# Altium project WPT Round 3 RX.PrjPcb
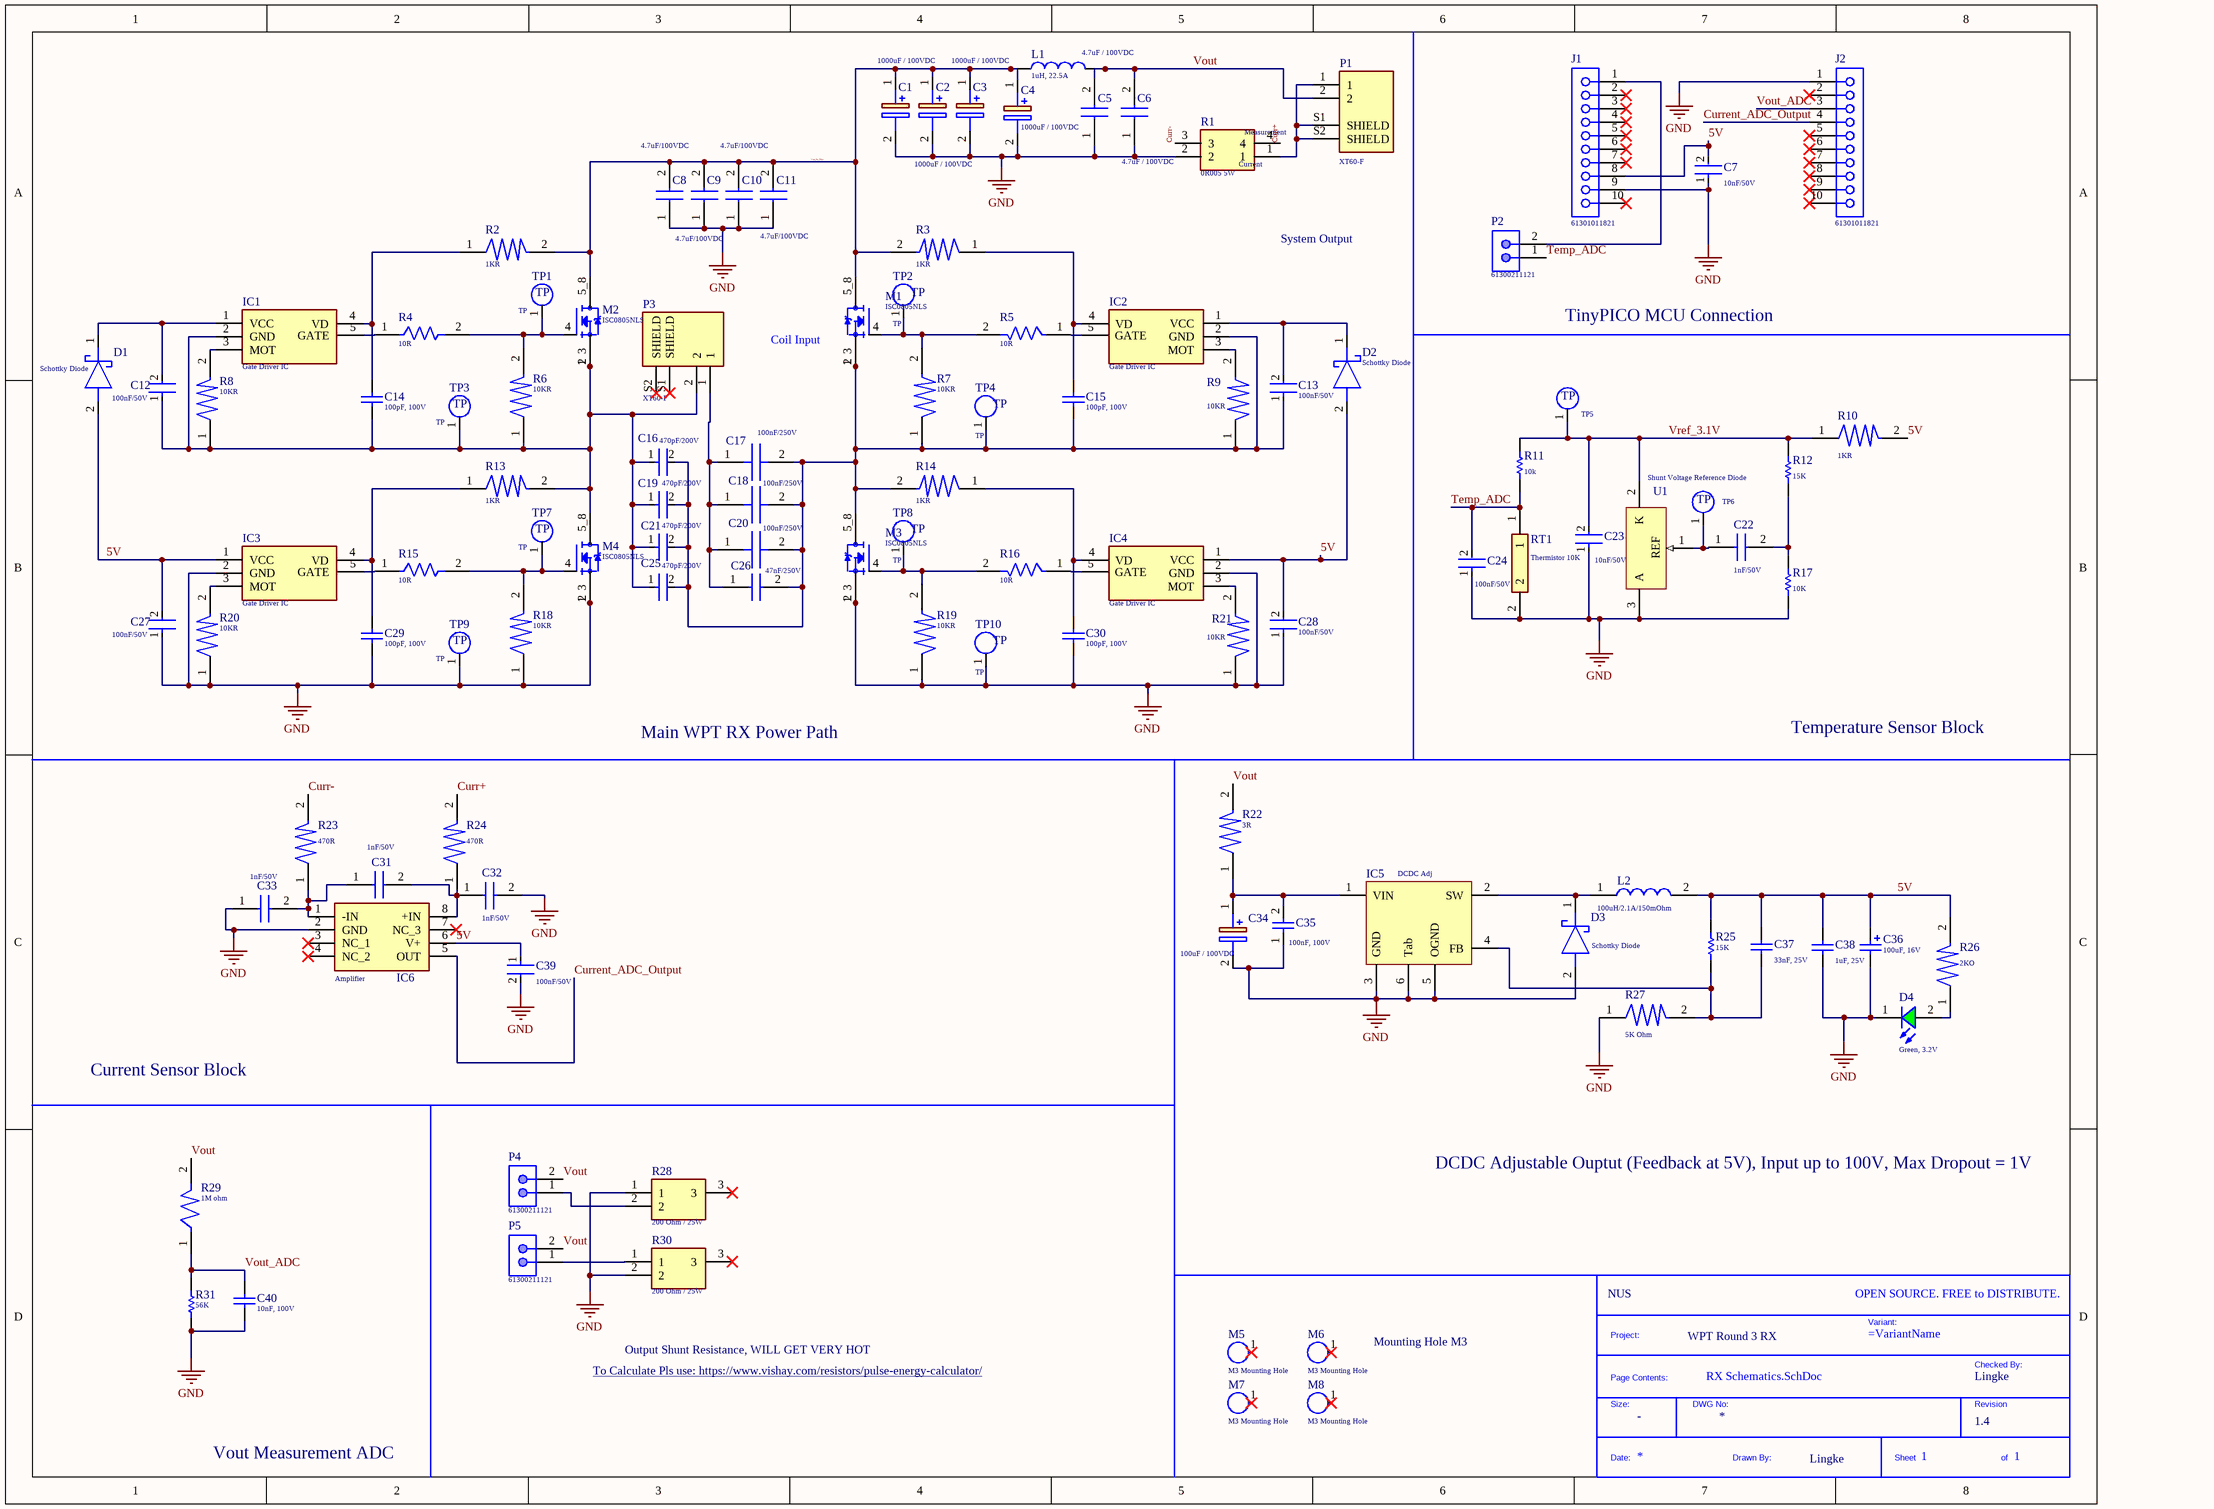
[diagram p0: RX Schematics.SchDoc]
1 sheet, 111 parts. Net scope: global (net labels, ports and power ports of the same name join across sheets).
Board file: RX Layout.PcbDoc

## Sheet RX Schematics.SchDoc
size A3; SheetNumber: 1; SheetTotal: 1

### Parts
*1  Project Name: WPT Round 3 RX  Company: NUS  Drawn By: Lingke  Revision: 1.4  (hidden comment: Title_Block)  (no BOM)
C1  1000uF / 100VDC  [CAPPRD750W80D1850H4200]
C2  1000uF / 100VDC  [CAPPRD750W80D1850H4200]
C3  1000uF / 100VDC  [CAPPRD750W80D1850H4200]
C4  1000uF / 100VDC  [CAPPRD750W80D1850H4200]
C5  4.7uF / 100VDC  [CAPC3225X280N]
C6  4.7uF / 100VDC  [CAPC3225X280N]
C7  10nF/50V  [0805 Capacitor]
C8  4.7uF/100VDC  [CAPC3225X280N]
C9  4.7uF/100VDC  [CAPC3225X280N]
C10  4.7uF/100VDC  [CAPC3225X280N]
C11  4.7uF/100VDC  [CAPC3225X280N]
C12  100nF/50V  [0805 Capacitor]
C13  100nF/50V  [0805 Capacitor]
C14  100pF, 100V  [WCAP-CSGP_0805_H=0.6mm_Reflow]
C15  100pF, 100V  [WCAP-CSGP_0805_H=0.6mm_Reflow]
C16  470pF/200V  [FP-C1206C-EB-MFG]
C17  100nF/250V  [CAPC4532X220N]
C18  100nF/250V  [CAPC4532X220N]
C19  470pF/200V  [FP-C1206C-EB-MFG]
C20  100nF/250V  [CAPC4532X220N]
C21  470pF/200V  [FP-C1206C-EB-MFG]
C22  1nF/50V  [CAPC2012X90N]
C23  10nF/50V  [0805 Capacitor]
C24  100nF/50V  [0805 Capacitor]
C25  470pF/200V  [FP-C1206C-EB-MFG]
C26  47nF/250V  [CAPC4532X350N]
C27  100nF/50V  [0805 Capacitor]
C28  100nF/50V  [0805 Capacitor]
C29  100pF, 100V  [WCAP-CSGP_0805_H=0.6mm_Reflow]
C30  100pF, 100V  [WCAP-CSGP_0805_H=0.6mm_Reflow]
C31  1nF/50V  [CAPC2012X90N]
C32  1nF/50V  [CAPC2012X90N]
C33  1nF/50V  [CAPC2012X90N]
C34  100uF / 100VDC  [CAPPRD500W60D1000H2200]
C35  100nF, 100V  [WCAP-CSGP_0805_H=1.25mm]
C36  100uF, 16V  [WCAP-ASLI_D6.3H5.5]
C37  33nF, 25V  [WCAP-CSGP_0805_H=0.8mm_Reflow]
C38  1uF, 25V  [WCAP-CSGP_0805_H=1.25mm]
C39  100nF/50V  [0805 Capacitor]
C40  10nF, 100V  [WCAP-CSGP_0805_H=0.8mm_Reflow]
D1  Schottky Diode  [RB400VAM50TR]
D2  Schottky Diode  [RB400VAM50TR]
D3  Schottky Diode  [DIONM8059X265N]
D4  Green, 3.2V  [WL-SMCW_0805]
IC1  Gate Driver IC  [SOT95P280X145-5N]
IC2  Gate Driver IC  [SOT95P280X145-5N]
IC3  Gate Driver IC  [SOT95P280X145-5N]
IC4  Gate Driver IC  [SOT95P280X145-5N]
IC5  DCDC Adj  [TO-263-5]
IC6  Amplifier  [SOIC127P600X175-8N]
J1  61301011821  [61301011821]
J2  61301011821  [61301011821]
L1  1uH, 22.5A  [7847227010]
L2  100uH/2.1A/150mOhm  [INDPM125125X800N]
M1  ISC0805NLS  [PG-TDSON-8]
M2  ISC0805NLS  [PG-TDSON-8]
M3  ISC0805NLS  [PG-TDSON-8]
M4  ISC0805NLS  [PG-TDSON-8]
M5  M3 Mounting Hole  [M3 Hole]
M6  M3 Mounting Hole  [M3 Hole]
M7  M3 Mounting Hole  [M3 Hole]
M8  M3 Mounting Hole  [M3 Hole]
P1  XT60-F  [AMASS_XT60PW-F]
P2  61300211121  [61300211121]
P3  XT60-F  [AMASS_XT60PW-F]
P4  61300211121  [61300211121]
P5  61300211121  [61300211121]
R1  0R005 5W  [FC4L110R005FER]
R2  1KR  [FP-CRCW0805-e3-MFG]
R3  1KR  [FP-CRCW0805-e3-MFG]
R4  10R  [FP-CRCW1206-e3-IPC_A]
R5  10R  [FP-CRCW1206-e3-IPC_A]
R6  10KR  [FP-CRCW0805-e3-MFG]
R7  10KR  [FP-CRCW0805-e3-MFG]
R8  10KR  [FP-CRCW0805-e3-MFG]
R9  10KR  [FP-CRCW0805-e3-MFG]
R10  1KR  [FP-CRCW0805-e3-MFG]
R11  10k  [0805 Resistor]
R12  15K  [0805 Resistor]
R13  1KR  [FP-CRCW0805-e3-MFG]
R14  1KR  [FP-CRCW0805-e3-MFG]
R15  10R  [FP-CRCW1206-e3-IPC_A]
R16  10R  [FP-CRCW1206-e3-IPC_A]
R17  10K  [0805 Resistor]
R18  10KR  [FP-CRCW0805-e3-MFG]
R19  10KR  [FP-CRCW0805-e3-MFG]
R20  10KR  [FP-CRCW0805-e3-MFG]
R21  10KR  [FP-CRCW0805-e3-MFG]
R22  3R  [1206_Resistor]
R23  470R  [FP-CRCW0805-e3-MFG]
R24  470R  [FP-CRCW0805-e3-MFG]
R25  15K  [0805 Resistor]
R26  2KO  [FP-CRCW0805-e3-MFG]
R27  5K Ohm  [FP-CRCW0805-e3-MFG]
R28  200 Ohm / 25W  [PWR163S253000FE]
R29  1M ohm  [FP-CRCW0805-e3-MFG]
R30  200 Ohm / 25W  [PWR163S253000FE]
R31  56K  [0805 Resistor]
RT1  Thermistor 10K  [THRMC2012X95N]
TP1  TP  [Test Point]  (no BOM)
TP2  TP  [Test Point]  (no BOM)
TP3  TP  [Test Point]  (no BOM)
TP4  TP  [Test Point]  (no BOM)
TP5  TP  [Test Point]  (value not drawn)  (no BOM)
TP6  TP  [Test Point]  (value not drawn)  (no BOM)
TP7  TP  [Test Point]  (no BOM)
TP8  TP  [Test Point]  (no BOM)
TP9  TP  [Test Point]  (no BOM)
TP10  TP  [Test Point]  (no BOM)
U1  Shunt Voltage Reference Diode  [SOT23-3_N]

### Nets
GND: C1.2(-) C2.2(-) C3.2(-) C4.2(-) C5.1 C6.1 C7.1 C8.1 C9.1 C10.1 C11.1 C23.1 C24.1 C27.1 C28.1 C29.1 C30.1 C32.2 C33.1 C34.2(-) C35.1 C36.2(N) C38.1 C39.2 C40.1 D3.2(A) D4.1(K) IC3.2(GND) IC4.2(GND) IC5.3(GND) IC5.5(OGND) IC5.6(Tab) IC6.2(GND) J1.9 J2.1 M3.1(S) M3.2(S) M3.3(S) M4.1(S) M4.2(S) M4.3(S) R1.2 R17.1 R18.1 R19.1 R20.1 R21.1 R27.1 R28.1 R30.2 R31.1 RT1.2 TP9.1(TP) TP10.1(TP) U1.3(A)
5V: C7.2 C27.2 C28.2 C36.1(P) C37.2 C38.2 C39.1 D1.2(A) D2.2(A) IC3.1(VCC) IC4.1(VCC) IC6.6(V+) J1.8 L2.2 R10.2 R25.2 R26.2
Curr+: R1.4 R24.2
Curr-: R1.3 R23.2
Current_ADC_Output: IC6.5(OUT) J2.4
Temp_ADC: C24.2 P2.1 R11.1 RT1.1
Vout: C5.2 C6.2 L1.2 P1.2 P4.2 P5.2 R22.2 R29.2
Vout_ADC: C40.2 J2.3 R29.1 R31.2
Vout_Pre_Filter: C1.1(+) C2.1(+) C3.1(+) C4.1(+) C8.2 C9.2 C10.2 C11.2 L1.1 M1.5_8(D) M2.5_8(D) R2.2 R3.2
Vref_3.1V: C23.2 R10.1 R11.2 R12.2 TP5.1(TP) U1.2(K)
NetC12_1: C12.1 C14.1 C16.1 C19.1 C21.1 C25.1 IC1.2(GND) M2.1(S) M2.2(S) M2.3(S) M4.5_8(D) P3.2 R6.1 R8.1 R13.2 TP3.1(TP)
NetC12_2: C12.2 D1.1(K) IC1.1(VCC)
NetC13_1: C13.1 C15.1 C16.2 C17.2 C18.2 C19.2 C20.2 C21.2 C25.2 C26.2 IC2.2(GND) M1.1(S) M1.2(S) M1.3(S) M3.5_8(D) R7.1 R9.1 R14.2 TP4.1(TP)
NetC13_2: C13.2 D2.1(K) IC2.1(VCC)
NetC14_2: C14.2 IC1.4(VD) R2.1
NetC15_2: C15.2 IC2.4(VD) R3.1
NetC17_1: C17.1 C18.1 C20.1 C26.1 P3.1
NetC22_1: C22.1 TP6.1(TP) U1.1(REF)
NetC22_2: C22.2 R12.1 R17.2
NetC29_2: C29.2 IC3.4(VD) R13.1
NetC30_2: C30.2 IC4.4(VD) R14.1
NetC31_1: C31.1 C33.2 IC6.1(-IN) R23.1
NetC31_2: C31.2 C32.1 IC6.8(+IN) R24.1
NetC34_1: C34.1(+) C35.2 IC5.1(VIN) R22.1
NetC37_1: C37.1 IC5.4(FB) R25.1 R27.2
NetD3_1: D3.1(K) IC5.2(SW) L2.1
NetD4_2: D4.2(A) R26.1
NetIC1_3: IC1.3(MOT) R8.2
NetIC1_5: IC1.5(GATE) R4.1
NetIC2_3: IC2.3(MOT) R9.2
NetIC2_5: IC2.5(GATE) R5.1
NetIC3_3: IC3.3(MOT) R20.2
NetIC3_5: IC3.5(GATE) R15.1
NetIC4_3: IC4.3(MOT) R21.2
NetIC4_5: IC4.5(GATE) R16.1
NetJ1_1: J1.1 P2.2
NetM1_4: M1.4(G) R5.2 R7.2 TP2.1(TP)
NetM2_4: M2.4(G) R4.2 R6.2 TP1.1(TP)
NetM3_4: M3.4(G) R16.2 R19.2 TP8.1(TP)
NetM4_4: M4.4(G) R15.2 R18.2 TP7.1(TP)
NetP1_1: P1.1 P1.S1(SHIELD) P1.S2(SHIELD) R1.1
NetP4_1: P4.1 R28.2
NetP5_1: P5.1 R30.1

Not connected (* = marked no-connect by the designer): IC6 3(NC_1)* 4(NC_2)* 7(NC_3)*; J1 2* 3* 4* 5* 6* 7* 10*; J2 2* 5* 6* 7* 8* 9* 10*; M5 1*; M6 1*; M7 1*; M8 1*; P3 S1(SHIELD)* S2(SHIELD)*; R28 3*; R30 3*

### Notes on the sheet
- System Output
- (near M1) Coil Input
- TinyPICO MCU Connection
- Main WPT RX Power Path
- Temperature Sensor Block
- Current Sensor Block
- DCDC Adjustable Ouptut (Feedback at 5V), Input up to 100V, Max Dropout = 1V
- To Calculate Pls use: https://www.vishay.com/resistors/pulse-energy-calculator/ <https://www.vishay.com/resistors/pulse-energy-calculator/>
- Output Shunt Resistance, WILL GET VERY HOT
- Mounting Hole M3
- Vout Measurement ADC
- (in symbol FC4L110R005FER) Measurement; Current
- (in symbol Title_Block) OPEN SOURCE. FREE to DISTRIBUTE.; Variant:; Project:; Checked By:; Page Contents:; Size:; DWG No:; Revision; Date:; Drawn By:; Sheet; of

### Library data of the parts
*1 = Title_Block: Standard Title Block.; DWG No: *; Size: -; Checked By: Lingke
C1-C4 = UPW2A102MHD: Capacitor Polarised; Manufacturer_Name: Nichicon; Datasheet Link: http://www.nichicon.co.jp/english/products/pdfs/e-pw.pdf; Height: 42mm; Manufacturer_Part_Number: UPW2A102MHD; Mouser Part Number: 647-UPW2A102MHD; Mouser Price/Stock: https://www.mouser.co.uk/ProductDetail/Nichicon/UPW2A102MHD/?qs=vtm6YctIBsEhKvWuRIWL3Q%3D%3D; Arrow Part Number: UPW2A102MHD; Arrow Price/Stock: https://www.arrow.com/en/products/upw2a102mhd/nichicon
C5 C6 = CL32B475KCVZNWE: Capacitor; Manufacturer_Name: Samsung Electro-Mechanics; Height: 2.8mm; Manufacturer_Part_Number: CL32B475KCVZNWE
C7 C23 = 885012207092: Supplier 1: Mouser; Supplier Part Number 1: 710-885012207092
C8-C11 = CNC6P1X7R2A475K250AE: Manufacturer_Name: TDK; Datasheet Link: https://componentsearchengine.com//CNC6P1X7R2A475K250AE.pdf; Height: 2.8mm; Mouser2 Part Number: 810-CNC6P1X7R2A475K2; Mouser2 Price/Stock: https://www.mouser.com/Search/Refine.aspx?Keyword=810-CNC6P1X7R2A475K2; Manufacturer_Part_Number: CNC6P1X7R2A475K250AE; Supplier 1: Mouser; Supplier Part Number 1: 810-CNC6P1X7R2A475K2
C12 C13 C24 C27 C28 C39 = 885012207098: Supplier 1: Mouser; Supplier Part Number 1: 710-885012207098
C14 C15 C29 C30 = 885012007082: WCAP-CSGP Multilayer Ceramic Chip Capacitor, General Purpose, size 0805, NP0, 100pF, 100V; Manufacturer: Wurth Elektronik; Rated Voltage: 100VDC; Isolation Resistance  min.: 10GOhm; Capacitance Tolerance: +/-5%; Technical Reference: NP00805101J100DFCT10000; Q-Factor min.: 1000; ComponentLink1Description: Manufacturer; ComponentLink1URL: http://www.we-online.de; ComponentLink2Description: Datasheet; ComponentLink2URL: https://www.we-online.com/catalog/datasheet/885012007082.pdf; Operating Temperature: -55 to +125degC; Packaging: Tape and Reel; Manufacturer Part Number: 885012007082; Published Date: April 2021; Ceramic Type: NP0; Dissipation Factor max.: -; Height: 0.6mm; Mounting Technology: SMT; Size: 0805; Capacitance: 100pF
C16 C19 C21 C25 = C1206C471K2GACTU: CAP CER 470PF 200V 10% NP0 1206; Manufacturer: KEMET; Temperature Coefficient: 15%; Material: Ceramic; Tolerance: 0.1; Automotive Grade: Grade 0; Temperature Characteristic: C0G; Temperature Range High: +150°C; Octopart: https://octopart.com/c1206c471k2gactu-kemet-3658280; Value: 470 pF; ComponentLink2URL: https://content.kemet.com/datasheets/KEM_C1007_X8R_ULTRA_150C_SMD.pdf; Package: C1206C-EB; Ipc Land Pattern Name: CAPC320160X78; Digikey Description: CAP CER 470PF 200V 10% NP0 1206; Device Class L2: Capacitors; Lead Free: Yes; Voltage Rating: 200 V; ComponentLink2Description: Datasheet; Height: 0.88mm; RoHS: TRUE; Temperature Range Low: -55°C; Device Class L1: Passive Components; Device Class L3: Ceramic Capacitors; Category: Cap; Mouser Description: Multilayer Ceramic Capacitors MLCC - SMD/SMT 200volts 470pF C0G 10%; Temperature: -55°C to +150°C; Capacitance: 470 pF; Manufacturer Part Number: C1206C471K2GACTU; Automotive: Yes
C17 C18 C20 = C1812C104JAGACAUTO: Manufacturer_Name: Kemet; Datasheet Link: https://api.kemet.com/component-edge/download/datasheet/C1812C104JAGACAUTO.pdf; Height: 2.2mm; Manufacturer_Part_Number: C1812C104JAGACAUTO; Supplier Part Number 1: 80-C1812C104JAGAUTO; Supplier 1: Mouser
C22 C31-C33 = 885012207086: Manufacturer_Name: Wurth Elektronik; Datasheet Link: https://katalog.we-online.com/pbs/datasheet/885012207086.pdf; Height: 0.9mm; Manufacturer_Part_Number: 885012207086; Supplier 1: Mouser; Supplier Part Number 1: 710-885012207086
C26 = C4532C0G2E473J320KA: Capacitor / 47nF/250V / C0G; Manufacturer_Name: TDK; Datasheet Link: https://product.tdk.com/info/en/catalog/datasheets/mlcc_commercial_midvoltage_en.pdf; Height: 3.5mm; Manufacturer_Part_Number: C4532C0G2E473J320KA; Supplier 1: Mouser; Supplier Part Number 1: 810-C4532C0G2E473J
C34 = ESH107M100AH4AA: Capacitor Polarised; Manufacturer_Name: Kemet; Datasheet Link: https://componentsearchengine.com/Datasheets/1/ESH107M100AH4AA.pdf; Height: 22mm; Manufacturer_Part_Number: ESH107M100AH4AA; Mouser Part Number: 80-ESH107M100AH4AA; Mouser Price/Stock: https://www.mouser.co.uk/ProductDetail/KEMET/ESH107M100AH4AA?qs=gt1LBUVyoHkVRbiIYuZpEw%3D%3D
C35 = 885012207128: WCAP-CSGP Multilayer Ceramic Chip Capacitor, General Purpose, size 0805, X7R, 100nF, 100V; Manufacturer: Wurth Elektronik; Rated Voltage: 100VDC; Isolation Resistance: >=1GOhm; Capacitance Tolerance: +/-10%; Technical Reference: X7R0805104K100DFCT10000; ComponentLink1Description: Manufacturer; ComponentLink1URL: http://www.we-online.de; ComponentLink2Description: Datasheet; ComponentLink2URL: https://www.we-online.com/catalog/datasheet/885012207128.pdf; Operating Temperature: -55 to +125degC; Packaging: Tape and Reel; Manufacturer Part Number: 885012207128; Published Date: May 2020; Ceramic Type: X7R; Dissipation Factor: =<2.5%; Height: 1.25mm; Mounting Technology: SMT; Size: 0805; Capacitance: 100nF
C36 = 865080343009: WCAP-ASLI Aluminum Electrolytic Capacitor, V-Chip, SMT, D6.3xH5.5mm, 100uF, 16V; Manufacturer: Wurth Elektronik; Technical Reference: ASED055101M016DVCTBB000; Ripple Current: 255mA; Capacitance Tolerance: +/-20%; Leakage Current: 16uA; Endurance: 2000h; Dissipation Factor: 16%; Rated Voltage: 16VDC; Packaging: Tape and Reel; Published Date: October 2020; Operating Temperature: -55 to +105degC; Mounting Technology: SMT; Manufacturer Part Number: 865080343009; Height: 5.5mm; Capacitance: 100uF; ComponentLink1Description: Manufacturer; ComponentLink1URL: http://www.we-online.de; ComponentLink2Description: Datasheet; ComponentLink2URL: https://www.we-online.com/catalog/datasheet/865080343009.pdf; Diameter: 6.3mm
C37 = 885012207069: WCAP-CSGP Multilayer Ceramic Chip Capacitor, General Purpose, size 0805, X7R, 33nF, 25V; Manufacturer: Wurth Elektronik; Rated Voltage: 25VDC; Isolation Resistance  min.: 10GOhm; Capacitance Tolerance: +/-10%; Dissipation Factor max.: 3.5%; Technical Reference: X7R0805333K025DFCT10000; ComponentLink1Description: Manufacturer; ComponentLink1URL: http://www.we-online.de; ComponentLink2Description: Datasheet; ComponentLink2URL: https://www.we-online.com/catalog/datasheet/885012207069.pdf; Operating Temperature: -55 to +125degC; Packaging: Tape and Reel; Manufacturer Part Number: 885012207069; Published Date: April 2021; Ceramic Type: X7R; Height: 0.8mm; Mounting Technology: SMT; Size: 0805; Capacitance: 33nF; Q-Factor min.: -
C38 = 885012207078: WCAP-CSGP Multilayer Ceramic Chip Capacitor, General Purpose, size 0805, X7R, 1uF, 25V; Manufacturer: Wurth Elektronik; Rated Voltage: 25VDC; Isolation Resistance  min.: 0.5GOhm; Capacitance Tolerance: +/-10%; Dissipation Factor max.: 5%; Technical Reference: X7R0805105K025DFCT10000; ComponentLink1Description: Manufacturer; ComponentLink1URL: http://www.we-online.de; ComponentLink2Description: Datasheet; ComponentLink2URL: https://www.we-online.com/catalog/datasheet/885012207078.pdf; Operating Temperature: -55 to +125degC; Packaging: Tape and Reel; Manufacturer Part Number: 885012207078; Published Date: April 2021; Ceramic Type: X7R; Height: 1.25mm; Mounting Technology: SMT; Size: 0805; Capacitance: 1uF; Q-Factor min.: -
C40 = 885012207122: WCAP-CSGP Multilayer Ceramic Chip Capacitor, General Purpose, size 0805, X7R, 10nF, 100V; Manufacturer: Wurth Elektronik; Rated Voltage: 100VDC; Isolation Resistance  min.: 10GOhm; Capacitance Tolerance: +/-10%; Dissipation Factor max.: 2.5%; Technical Reference: X7R0805103K100DFCT10000; ComponentLink1Description: Manufacturer; ComponentLink1URL: http://www.we-online.de; ComponentLink2Description: Datasheet; ComponentLink2URL: https://www.we-online.com/catalog/datasheet/885012207122.pdf; Operating Temperature: -55 to +125degC; Packaging: Tape and Reel; Manufacturer Part Number: 885012207122; Published Date: April 2021; Ceramic Type: X7R; Height: 0.8mm; Mounting Technology: SMT; Size: 0805; Capacitance: 10nF; Q-Factor min.: -
D1 D2 = RB400VAM-50TR: Manufacturer_Name: ROHM Semiconductor; Datasheet Link: https://componentsearchengine.com//RB400VAM-50TR.pdf; Height: 0.8mm; Mouser2 Part Number: 755-RB400VAM-50TR; Mouser2 Price/Stock: https://www.mouser.com/Search/Refine.aspx?Keyword=755-RB400VAM-50TR; Manufacturer_Part_Number: RB400VAM-50TR; Supplier Part Number 1: 755-RB400VAM-50TR; Supplier 1: Mouser
D3 = S310: Manufacturer_Name: ON Semiconductor; Datasheet Link: https://componentsearchengine.com/Datasheets/2/S310.pdf; Height: 2.65mm; Manufacturer_Part_Number: S310; Mouser Part Number: 512-S310; Mouser Price/Stock: https://www.mouser.co.uk/ProductDetail/ON-Semiconductor-Fairchild/S310?qs=AZz8fAaf6P%2FJSlbiibJLxA%3D%3D; Arrow Part Number: S310; Arrow Price/Stock: https://www.arrow.com/en/products/s310/on-semiconductor?region=nac
D4 = 150080GS75000: WL-SMCW SMT Mono-color Chip LED Waterclear, size 0805, Green, 3.2V, 140deg; Chip Technology: InGaN; Dominant Wavelength typ.: 525nm; Luminous Intensity typ.: 450mcd; Peak Wavelength typ.: 515nm; Viewing Angle: 140deg; ComponentLink1Description: Manufacturer; ComponentLink1URL: http://www.we-online.de; ComponentLink2URL: https://www.we-online.com/catalog/datasheet/150080GS75000.pdf; ComponentLink2Description: Datasheet; Forward Voltage typ.: 3.2V; Emitting Color: Green; Mounting Technology: SMT; Operating Temperature: -40 to +85degC; Published Date: December 2019; Part Number: 150080GS75000; Packaging: Tape and Reel; Size: 0805; Publisher: Wurth Elektronik
IC1-IC4 = IR1161LTRPBF: Manufacturer_Name: Infineon; Height: 1.45mm; Manufacturer_Part_Number: IR1161LTRPBF; Supplier 1: Mouser; Supplier Part Number 1: 942-IR1161LTRPBF
IC5 = XL7035E1
IC6 = AD8215YRZ: Integrated Circuit Amplifier; Manufacturer_Name: Analog Devices; Datasheet Link: http://www.analog.com/static/imported-files/data_sheets/AD8215.pdf; Height: 1.75mm; Manufacturer_Part_Number: AD8215YRZ; Supplier 1: Mouser; Supplier Part Number 1: 584-AD8215YRZ
J1 J2 = 61301011821: WR-PHD Socket Header, THT, pitch 2.54mm, Single Row, Vertical, 10p; Manufacturer: Wurth Elektronik; Pin Number: 10; Rated Current: 3A; Working Voltage: 250VAC; Withstanding Voltage: 500VAC; Contact Resistance: 20mOhm; ComponentLink1Description: Manufacturer; ComponentLink1URL: http://www.we-online.de; ComponentLink2Description: Datasheet; ComponentLink2URL: https://www.we-online.com/catalog/datasheet/61301011821.pdf; Manufacturer Part Number: 61301011821; Published Date: May 2020; Pitch: 2.54mm; Operating Temperature: -40 to +125degC; Mounting Technology: THT; Packaging: Tray; Gender: Socket Header; Row Number: Single; Orientation: Vertical
L1 = 7847227010: WE-RCIS SMT Rod Core Inductor, 1uH, 22.5A; Manufacturer: Wurth Elektronik; DC Resistance: 2mOhm; Self Resonant Frequency: 213MHz; Saturation Current: 29A; ComponentLink1Description: Manufacturer; ComponentLink1URL: http://www.we-online.de; ComponentLink2Description: Datasheet; ComponentLink2URL: https://www.we-online.com/catalog/datasheet/7847227010.pdf; Manufacturer Part Number: 7847227010; Published Date: Feburary 2021; Rated Current: 22.5A; Inductance: 1uH; Operating Temperature: -40 to +150degC; Mounting Technology: SMT; Packaging: Tape and Reel; Diameter: 7.1mm; Length: 15mm
L2 = SRR1280-101M: Inductor; Manufacturer_Name: Bourns; Datasheet Link: https://componentsearchengine.com/Datasheets/2/SRR1280-101M.pdf; Height: 8mm; Manufacturer_Part_Number: SRR1280-101M; Mouser Part Number: 652-SRR1280-101M; Mouser Price/Stock: https://www.mouser.co.uk/ProductDetail/Bourns/SRR1280-101M?qs=brMhP%2FMjUfd8D85Ep5aW7g%3D%3D; Arrow Part Number: SRR1280-101M; Arrow Price/Stock: https://www.arrow.com/en/products/srr1280-101m/bourns
M1-M4 = ISC0805NLS: N-Channel 100V 71A 72; MP: BSC010NE2LSI; Package: None; Price: None; Value: *; Availability: Unavailable
M5-M8 = M3_Mounting_hole
P1 P3 = XT60PW-F: Socket DC Supply Connector Female; MF: AMASS; Availability: Unavailable; SnapEDA_Link: https://www.snapeda.com/parts/XT60PW-F/AMASS/view-part/2890674/?ref=snap; MP: XT60PW-F; Value: *; Price: None; Package: Package; BuyPart: https://www.snapeda.com/parts/XT60PW-F/AMASS/view-part/2890674/?ref=eda
P2 P4 P5 = 61300211121: WR-PHD Pin Header, THT, pitch 2.54mm, Single Row, Vertical, 2p; Manufacturer: Wurth Elektronik; Pin Number: 2; Rated Current: 3A; Working Voltage: 250VAC; Withstanding Voltage: 500VAC; Contact Resistance: 20mOhm; ComponentLink1Description: Manufacturer; ComponentLink1URL: http://www.we-online.de; ComponentLink2Description: Datasheet; ComponentLink2URL: https://www.we-online.com/catalog/datasheet/61300211121.pdf; Manufacturer Part Number: 61300211121; Published Date: May 2020; Pitch: 2.54mm; Operating Temperature: -40 to +105degC; Mounting Technology: THT; Packaging: Bag; Gender: Pin Header; Row Number: Single; Orientation: Vertical
R1 = FC4L110R005FER: Resistor 0R005 5W; Manufacturer_Name: Ohmite; Height: 0.7mm; Manufacturer_Part_Number: FC4L110R005FER; Supplier 1: Mouser; Supplier Part Number 1: 588-FC4L110R005FER
R2 R3 R10 R13 R14 = CRCW08051K00FKEA: Resistor 1k Ohm; Number of Terminations: 2; Supplier 1: Mouser; Supplier Part Number 1: 71-CRCW0805-1.0K-E3
R4 R5 R15 R16 = CRCW120610R0FKEA: RES Thick Film, 10Ω, 1%, 0.25W, 100ppm/°C, 1206 / MOSFET Gate Resistor 10Ohm; Power Rating: 250mW; Voltage Rating (DC): 200V; Number of Terminations: 2; Width: 0.063inch; Case Code (Imperial): 1206; Depth: 1.6mm; Contact Plating: Tin; Radiation Hardening: No; Lead Free: Lead Free; Length: 3.2mm; Tolerance: 1%; Max Power Dissipation: 250mW; Composition: Thick Film; Weight: 0.000353oz; Case/Package: 1206; Number of Pins: 2; Package Quantity: 10; Min Operating Temperature: -55°C; Military Standard: Not; Max Operating Temperature: 155°C; Termination: SMD/SMT; Case Code (Metric): 3216; Voltage Rating: 200V; Height: 0.55mm; Features: Automotive AEC-Q200; Temperature Coefficient: 100ppm/°C; Resistance: 10R; Packaging: Tape and Reel; Supplier 1: Digi-Key; Supplier Part Number 1: 541-10.0FDKR-ND
R6-R9 R18-R21 = CRCW080510K0FKEA: Resistor 10K Ohm; Number of Terminations: 2; Supplier 1: Mouser; Supplier Part Number 1: 71-CRCW0805-10K-E3
R11 = ERA-6ARB103V: High Presition and High reliability 10K Ohm Resistor; Supplier 1: Mouser; Supplier Part Number 1: 667-ERA-6ARB103V
R12 = ERA-6ARW153V: High Presicion 15K Ohm; Supplier 1: Mouser; Supplier Part Number 1: 667-ERA-6ARW153V
R17 = CRCW080510K0FKEB: High Presicion 10K Ohm; Supplier 1: Newark; Supplier Part Number 1: 26R4046
R22 = CRCW12063R00FKEAHP: Resistor 3 Ohm; Number of Terminations: 2; Supplier 1: Mouser; Supplier Part Number 1: 71-CRCW0805-10K-E3
R23 R24 = CRCW0805470RFKEB: Resistor 470 Ohm; Number of Terminations: 2; Supplier 1: Mouser; Supplier Part Number 1: 71-CRCW0805470RFKEB
R25 = ERA-6AED153V: 15K Ohm Resistor; Supplier 1: Mouser; Supplier Part Number 1: 667-ERA-6AED153V
R26 = CRCW08052K00FKEB: RES Thick Film, 2kΩ, 1%, 0.125W, 100ppm/°C, 0805; Voltage Rating (DC): 150V; Power Rating: 125mW; Resistance: 2kR; Number of Terminations: 2; Weight: 0.000194oz; Contact Plating: Tin; Radiation Hardening: No; Package Quantity: 10000; Lead Free: Lead Free; Case Code (Metric): 2012; Height: 0.02inch; Case/Package: 0805; Width: 0.049inch; Max Operating Temperature: 155°C; Packaging: Tape and Reel; Termination: SMD/SMT; Temperature Coefficient: 100ppm/°C; Composition: Thick Film; Features: Automotive AEC-Q200; Min Operating Temperature: -55°C; Voltage Rating: 150V; Number of Pins: 2; Length: 0.079inch; Case Code (Imperial): 0805; Max Power Dissipation: 125mW; Tolerance: 1%; Supplier Part Number 1: 71-CRCW08052K00FKEB; Supplier 1: Mouser
R27 = CRCW08055K00FKTA: Resistor 5K Ohm; Number of Terminations: 2; Supplier 1: Mouser; Supplier Part Number 1: 71-CRCW08051K30FKEB
R28 R30 = PWR163S-25-2000FE: Resistor 200 Ohm / 25W; Manufacturer_Name: Bourns; Manufacturer_Part_Number: PWR163S-25-3000FE; Datasheet Link: https://componentsearchengine.com/Datasheets/1/PWR163S-25-3000FE.pdf; Height: 2.79mm; Supplier 1: Mouser; Supplier Part Number 1: 652-PWR163S253000FE
R29 = CRCW08051M00FKEA: RES Thick Film, 1MΩ, 1%, 0.125W, 100ppm/°C, 0805 / 1M Ohm Resistor; Voltage Rating (DC): 150V; Resistance: 1MR; Power Rating: 125mW; Packaging: Tape and Reel; Case Code (Metric): 2012; Case/Package: 0805; Width: 1.25mm; Mount: Surface Mount; Military Standard: Not; Radiation Hardening: No; Weight: 0.000194oz; Package Quantity: 5000; Max Operating Temperature: 155°C; Contact Plating: Tin; Composition: Thick Film; Number of Pins: 2; Tolerance: 1%; Termination: SMD/SMT; Case Code (Imperial): 0805; Depth: 1.25mm; Temperature Coefficient: 100ppm/°C; Min Operating Temperature: -55°C; Height: 0.45mm; Lead Free: Lead Free; Length: 2mm; Voltage Rating: 150V; Supplier 1: Mouser; Supplier Part Number 1: 71-CRCW08051M00FKEAH
R31 = ERJ-6ENF5622V: 56K Ohm Resistor; Supplier 1: Mouser; Supplier Part Number 1: 667-ERJ-6ENF5622V
RT1 = NTCS0805E3103HMT: Thermistor 10Kohm B Parameter: 3950k; Manufacturer_Name: Vishay; Datasheet Link: http://www.vishay.com/docs/29044/ntcs0805e3t.pdf; Height: 0.95mm; Manufacturer_Part_Number: NTCS0805E3103HMT; Supplier 1: Mouser; Supplier Part Number 1: 594-NTCS0805E3103HMT
TP1-TP10 = Test Point: Test Point 1mm by 1mm
U1 = TS432AILT: Shunt voltage reference, adjustable, 1.24 to 10V, 0.5% precision, 3-Pin SOT23-3L, Tape and Reel; ComponentLink1URL: http://www.st.com; PackageDescription: 3-Pin SOT-23 Package 0.95 mm Pitch, 2.4 mm Lead Span; ComponentLink2Description: Datasheet; DatasheetVersion: Apr-2008; ComponentLink1Description: Manufacturer URL; ComponentLink2URL: http://www.st.com/internet/com/TECHNICAL_RESOURCES/TECHNICAL_LITERATURE/DATASHEET/CD00003202.pdf; PackageVersion: 2011; PackageReference: SOT23-3; Supplier 1: Digi-Key; Supplier Part Number 1: 497-TS432AILTCT-ND